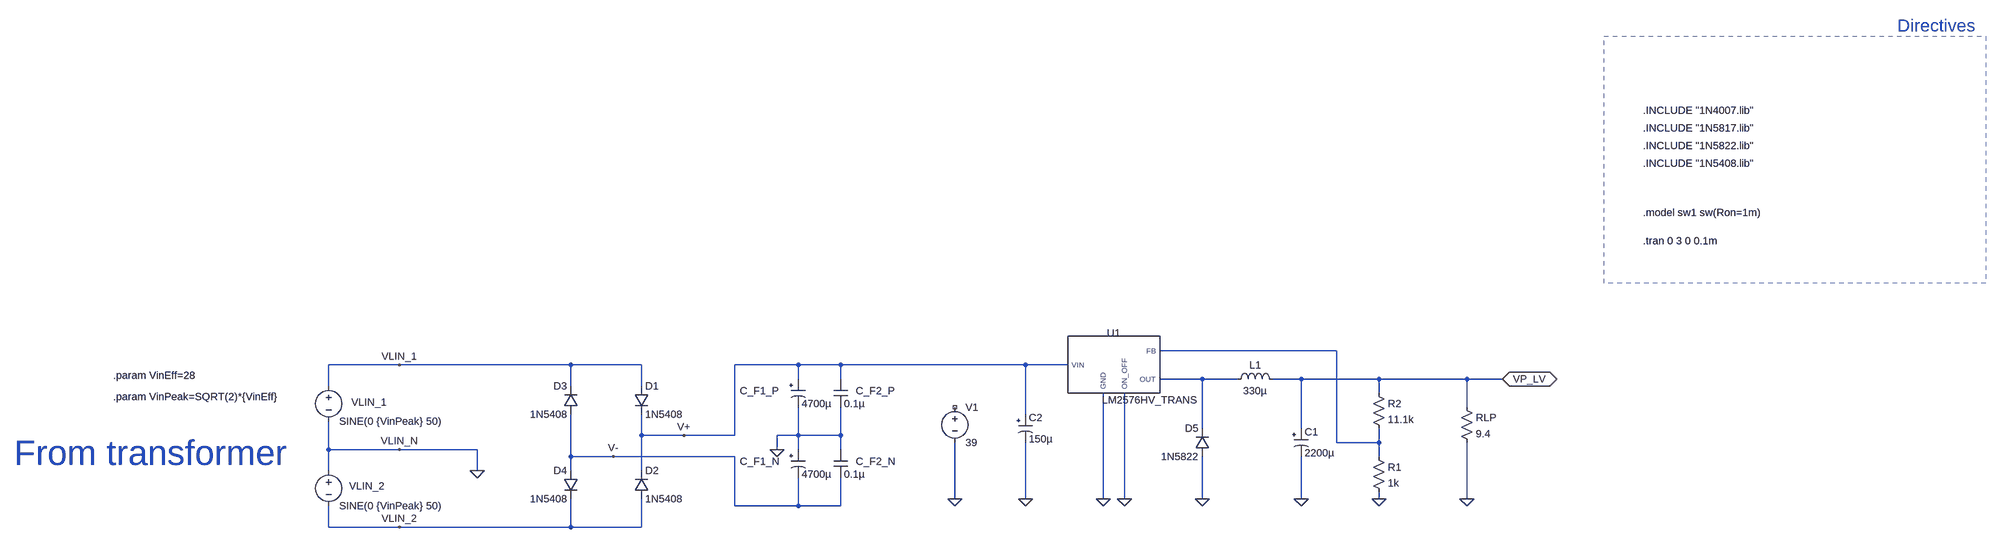
[diagram p0: schematic power_supply_V_0.1.asc]
power_supply_V_0.1.asc, the LTspice schematic file:
Version 4
SHEET 1 4716 1220
WIRE 2720 -576 2320 -576
WIRE -96 -544 -256 -544
WIRE 752 -544 -96 -544
WIRE 912 -544 752 -544
WIRE 1280 -544 1136 -544
WIRE 1376 -544 1280 -544
WIRE 2016 -544 1376 -544
WIRE 2112 -544 2016 -544
WIRE 1280 -512 1280 -544
WIRE 1376 -512 1376 -544
WIRE 2416 -512 2320 -512
WIRE 2496 -512 2416 -512
WIRE 2640 -512 2576 -512
WIRE 2816 -512 2640 -512
WIRE 3200 -512 2816 -512
WIRE 3280 -512 3200 -512
WIRE -256 -496 -256 -544
WIRE 752 -496 752 -544
WIRE 912 -496 912 -544
WIRE 2816 -480 2816 -512
WIRE 3200 -448 3200 -512
WIRE 2016 -432 2016 -544
WIRE 2416 -400 2416 -512
WIRE 2640 -400 2640 -512
WIRE 912 -384 912 -432
WIRE 1008 -384 912 -384
WIRE 1136 -384 1136 -544
WIRE 1136 -384 1008 -384
WIRE 1280 -384 1280 -448
WIRE 1280 -384 1232 -384
WIRE 1376 -384 1376 -448
WIRE 1376 -384 1280 -384
WIRE 2720 -368 2720 -576
WIRE 2816 -368 2816 -400
WIRE 2816 -368 2720 -368
WIRE -256 -352 -256 -416
WIRE -96 -352 -256 -352
WIRE 80 -352 -96 -352
WIRE 1232 -352 1232 -384
WIRE 1280 -352 1280 -384
WIRE 1376 -352 1376 -384
WIRE 752 -336 752 -432
WIRE 848 -336 752 -336
WIRE 1136 -336 848 -336
WIRE 2816 -336 2816 -368
WIRE -256 -304 -256 -352
WIRE 80 -304 80 -352
WIRE 752 -304 752 -336
WIRE 912 -304 912 -384
WIRE 1856 -240 1856 -368
WIRE 2016 -240 2016 -368
WIRE 2192 -240 2192 -480
WIRE 2240 -240 2240 -480
WIRE 2416 -240 2416 -336
WIRE 2640 -240 2640 -336
WIRE 2816 -240 2816 -256
WIRE 3200 -240 3200 -368
WIRE 1136 -224 1136 -336
WIRE 1280 -224 1280 -288
WIRE 1280 -224 1136 -224
WIRE 1376 -224 1376 -288
WIRE 1376 -224 1280 -224
WIRE -256 -176 -256 -224
WIRE -96 -176 -256 -176
WIRE 752 -176 752 -240
WIRE 752 -176 -96 -176
WIRE 912 -176 912 -240
WIRE 912 -176 752 -176
FLAG -96 -544 VLIN_1
FLAG -96 -176 VLIN_2
FLAG -96 -352 VLIN_N
FLAG 80 -304 0
FLAG 848 -336 V-
FLAG 1008 -384 V+
FLAG 1232 -352 0
FLAG 2192 -240 0
FLAG 2240 -240 0
FLAG 2416 -240 0
FLAG 2640 -240 0
FLAG 2816 -240 0
FLAG 3200 -240 0
FLAG 3280 -512 VP_LV
IOPIN 3280 -512 BiDir
FLAG 1856 -240 0
FLAG 2016 -240 0
DATAFLAG 2864 -512 ""
SYMBOL voltage -256 -512 R0
WINDOW 123 0 0 Left 2
WINDOW 39 0 0 Left 2
WINDOW 0 51 53 Left 2
SYMATTR InstName VLIN_1
SYMATTR Value SINE(0 {VinPeak} 50)
SYMBOL diode 896 -496 R0
SYMATTR InstName D1
SYMATTR Value 1N5408
SYMBOL diode 896 -240 M180
WINDOW 0 24 64 Left 2
WINDOW 3 24 0 Left 2
SYMATTR InstName D2
SYMATTR Value 1N5408
SYMBOL polcap 1264 -512 R0
WINDOW 0 -116 27 Left 2
WINDOW 3 24 56 Left 2
SYMATTR InstName C_F1_P
SYMATTR Value 4700µ
SYMATTR Description Capacitor
SYMATTR Type cap
SYMATTR SpiceLine V=35 Irms=1.45 Rser=0.044 Lser=0 mfg="Nichicon" pn="UPR1V222MRH" type="Al electrolytic"
SYMBOL cap 1360 -512 R0
WINDOW 0 50 27 Left 2
SYMATTR InstName C_F2_P
SYMATTR Value 0.1µ
SYMATTR SpiceLine V=4 Irms=1.62 Rser=0.0464862 Lser=0 mfg="KEMET" pn="C0402C104K7PAC" type="X5R"
SYMBOL diode 768 -432 R180
WINDOW 0 24 64 Left 2
WINDOW 3 24 0 Left 2
SYMATTR InstName D3
SYMATTR Value 1N5408
SYMBOL diode 768 -304 M0
SYMATTR InstName D4
SYMATTR Value 1N5408
SYMBOL res 3184 -464 R0
SYMATTR InstName RLP
SYMATTR Value 9.4
SYMBOL voltage -256 -320 R0
WINDOW 123 0 0 Left 2
WINDOW 39 0 0 Left 2
WINDOW 0 46 51 Left 2
SYMATTR InstName VLIN_2
SYMATTR Value SINE(0 {VinPeak} 50)
SYMBOL polcap 1264 -352 R0
WINDOW 0 -116 27 Left 2
WINDOW 3 24 56 Left 2
SYMATTR InstName C_F1_N
SYMATTR Value 4700µ
SYMATTR Description Capacitor
SYMATTR Type cap
SYMATTR SpiceLine V=35 Irms=1.45 Rser=0.044 Lser=0 mfg="Nichicon" pn="UPR1V222MRH" type="Al electrolytic"
SYMBOL cap 1360 -352 R0
WINDOW 0 50 27 Left 2
SYMATTR InstName C_F2_N
SYMATTR Value 0.1µ
SYMATTR SpiceLine V=4 Irms=1.62 Rser=0.0464862 Lser=0 mfg="KEMET" pn="C0402C104K7PAC" type="X5R"
SYMBOL diode 2432 -336 R180
WINDOW 0 24 64 Left 2
WINDOW 3 24 0 Left 2
SYMATTR InstName D5
SYMATTR Value 1N5822
SYMBOL ind 2480 -496 R270
WINDOW 0 32 56 VTop 2
WINDOW 3 5 56 VBottom 2
SYMATTR InstName L1
SYMATTR Value 330µ
SYMBOL polcap 2624 -400 R0
SYMATTR InstName C1
SYMATTR Value 2200µ
SYMBOL res 2800 -352 R0
SYMATTR InstName R1
SYMATTR Value 1k
SYMBOL res 2800 -496 R0
SYMATTR InstName R2
SYMATTR Value 11.1k
SYMBOL LM2576HV_TRANS 2208 -544 R0
SYMATTR InstName U1
SYMBOL voltage 1856 -464 R0
SYMATTR InstName V1
SYMATTR Value 39
SYMBOL polcap 2000 -432 R0
SYMATTR InstName C2
SYMATTR Value 150µ
TEXT -968 -344 Left 6 ;From transformer
TEXT 3912 -1232 Left 2 !.tran 0 3 0 0.1m
TEXT 3912 -1528 Left 2 !.INCLUDE "1N4007.lib"
TEXT 3912 -1488 Left 2 !.INCLUDE "1N5817.lib"
TEXT 3912 -1448 Left 2 !.INCLUDE "1N5822.lib"
TEXT 3912 -1296 Left 2 !.model sw1 sw(Ron=1m)
TEXT 4488 -1720 Left 4 ;Directives
TEXT 3912 -1408 Left 2 !.INCLUDE "1N5408.lib"
TEXT -744 -520 Left 2 !.param VinEff=28
TEXT -744 -472 Left 2 !.param VinPeak=SQRT(2)*{VinEff}
RECTANGLE Normal 4688 -1136 3824 -1696 3

The netlist it stands for:
* power_supply_V_0.1.asc
VLIN_1 VLIN_1 0 SINE(0 {VinPeak} 50)
D1 VLIN_1 V+ 1N5408
D2 VLIN_2 V+ 1N5408
C_F1_P V+ 0 4700µ V=35 Irms=1.45 Rser=0.044 Lser=0 mfg="Nichicon" pn="UPR1V222MRH" type="Al electrolytic"
C_F2_P V+ 0 0.1µ V=4 Irms=1.62 Rser=0.0464862 Lser=0 mfg="KEMET" pn="C0402C104K7PAC" type="X5R"
D3 V- VLIN_1 1N5408
D4 V- VLIN_2 1N5408
RLP VP_LV 0 9.4
VLIN_2 0 VLIN_2 SINE(0 {VinPeak} 50)
C_F1_N 0 V- 4700µ V=35 Irms=1.45 Rser=0.044 Lser=0 mfg="Nichicon" pn="UPR1V222MRH" type="Al electrolytic"
C_F2_N 0 V- 0.1µ V=4 Irms=1.62 Rser=0.0464862 Lser=0 mfg="KEMET" pn="C0402C104K7PAC" type="X5R"
D5 0 N002 1N5822
L1 N002 VP_LV 330µ
C1 VP_LV 0 2200µ
R1 N001 0 1k
R2 VP_LV N001 11.1k
XU1 V+ N002 0 N001 0 LM2576HV_TRANS  ; pins VIN OUT GND FB ON_OFF
V1 NC_01 0 39
C2 V+ 0 150µ
.model D D
.lib standard.dio
* From transformer
.tran 0 3 0 0.1m
.INCLUDE "1N4007.lib"
.INCLUDE "1N5817.lib"
.INCLUDE "1N5822.lib"
.model sw1 sw(Ron=1m)
* Directives
.INCLUDE "1N5408.lib"
.param VinEff=28
.param VinPeak=SQRT(2)*{VinEff}
.lib LM2576HV_TRANS.LIB
.backanno
.end